# Altium schematic sheet IR_Receivers.SchDoc
size A
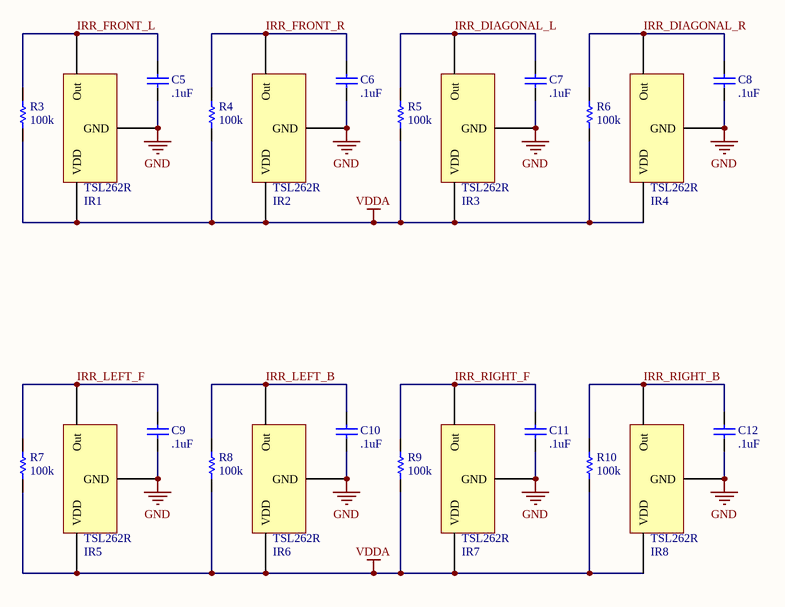
[diagram p0: IR_Receivers.SchDoc]

## Parts
C5  value .1uF  [1608[0603]]  (hidden comment: Cap Semi)
C6  value .1uF  [1608[0603]]  (hidden comment: Cap Semi)
C7  value .1uF  [1608[0603]]  (hidden comment: Cap Semi)
C8  value .1uF  [1608[0603]]  (hidden comment: Cap Semi)
C9  value .1uF  [1608[0603]]  (hidden comment: Cap Semi)
C10  value .1uF  [1608[0603]]  (hidden comment: Cap Semi)
C11  value .1uF  [1608[0603]]  (hidden comment: Cap Semi)
C12  value .1uF  [1608[0603]]  (hidden comment: Cap Semi)
IR1  TSL262R  [TSL262R]
IR2  TSL262R  [TSL262R]
IR3  TSL262R  [TSL262R]
IR4  TSL262R  [TSL262R]
IR5  TSL262R  [TSL262R]
IR6  TSL262R  [TSL262R]
IR7  TSL262R  [TSL262R]
IR8  TSL262R  [TSL262R]
R3  value 100k  [0603]  (hidden comment: Resistor)
R4  value 100k  [0603]  (hidden comment: Resistor)
R5  value 100k  [0603]  (hidden comment: Resistor)
R6  value 100k  [0603]  (hidden comment: Resistor)
R7  value 100k  [0603]  (hidden comment: Resistor)
R8  value 100k  [0603]  (hidden comment: Resistor)
R9  value 100k  [0603]  (hidden comment: Resistor)
R10  value 100k  [0603]  (hidden comment: Resistor)

## Nets
GND: C5.1 C6.1 C7.1 C8.1 C9.1 C10.1 C11.1 C12.1 IR1.0(GND) IR2.0(GND) IR3.0(GND) IR4.0(GND) IR5.0(GND) IR6.0(GND) IR7.0(GND) IR8.0(GND)
VDDA: IR1.1(VDD) IR2.1(VDD) IR3.1(VDD) IR4.1(VDD) IR5.1(VDD) IR6.1(VDD) IR7.1(VDD) IR8.1(VDD) R3.1 R4.1 R5.1 R6.1 R7.1 R8.1 R9.1 R10.1
IRR_DIAGONAL_L: C7.2 IR3.2(Out) R5.2
IRR_DIAGONAL_R: C8.2 IR4.2(Out) R6.2
IRR_FRONT_L: C5.2 IR1.2(Out) R3.2
IRR_FRONT_R: C6.2 IR2.2(Out) R4.2
IRR_LEFT_B: C10.2 IR6.2(Out) R8.2
IRR_LEFT_F: C9.2 IR5.2(Out) R7.2
IRR_RIGHT_B: C12.2 IR8.2(Out) R10.2
IRR_RIGHT_F: C11.2 IR7.2(Out) R9.2

## Library data of the parts
C5-C12 = Cap Semi: Capacitor (Semiconductor SIM Model); Published: 8-Jun-2000; LatestRevisionDate: 29-May-2009; LatestRevisionNote: IPC-7351 Footprint Added.; PackageReference: C1206; Publisher: Altium Limited; PackageDescription: Chip Capacitor
R3-R10 = Resistor: Published: 8-Jun-2000; LatestRevisionDate: 17-Jul-2002; LatestRevisionNote: Re-released for DXP Platform.; PackageReference: AXIAL-0.3; Publisher: Altium Limited